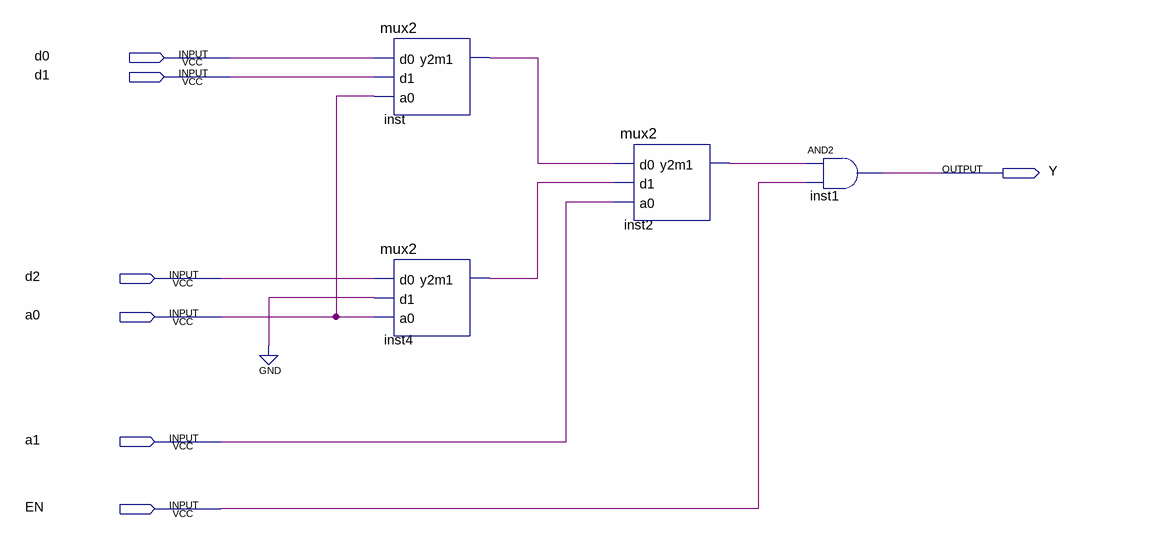
[diagram p0: schematic sheet]
// Quartus schematic mux3_en.bdf as structural Verilog: 4 symbols, 7 pins
module mux3_en (
  input  d0,
  input  d1,
  input  d2,
  input  a0,
  input  a1,
  input  EN,
  output Y
);

  wire inst2_y2m1, inst4_y2m1, inst_y2m1;

  mux2 inst (.d0(d0), .d1(d1), .a0(a0), .y2m1(inst_y2m1));
  mux2 inst4 (.d0(d2), .d1(1'b0), .a0(a0), .y2m1(inst4_y2m1));
  mux2 inst2 (.d0(inst_y2m1), .d1(inst4_y2m1), .a0(a1), .y2m1(inst2_y2m1));
  and inst1 (Y, inst2_y2m1, EN);
endmodule
